# EasyEDA Pro project 3轴6.0__esp32.eprj, schematic 2轴6.0原理图-V1.0
Board Name: 2轴6.0原理图-V1.0; Create Date: 2025-02-12; Page Name: 2轴6.0原理图-V1.0; Project Name: 3轴6.0__esp32; Schematic Name: 2轴6.0原理图-V1.0; Update Date: 2025-02-19; Address1: *; Address2: *; Address3: *; Address4: *; Application_BuildNumber: *; ApprovedBy: *; Author: *; CheckedBy: *; CompanyName: *; CurrentDate: *; CurrentTime: *; Date: *; DocumentFullPathAndName: *; DocumentName: *; DocumentNumber: *; DrawnBy: *; Engineer: *; ImagePath: *; ModifiedDate: *; Organization: *; ProjectName: *; Revision: *; Rule: *; SheetNumber: *; SheetTotal: *; Time: *; Title: *
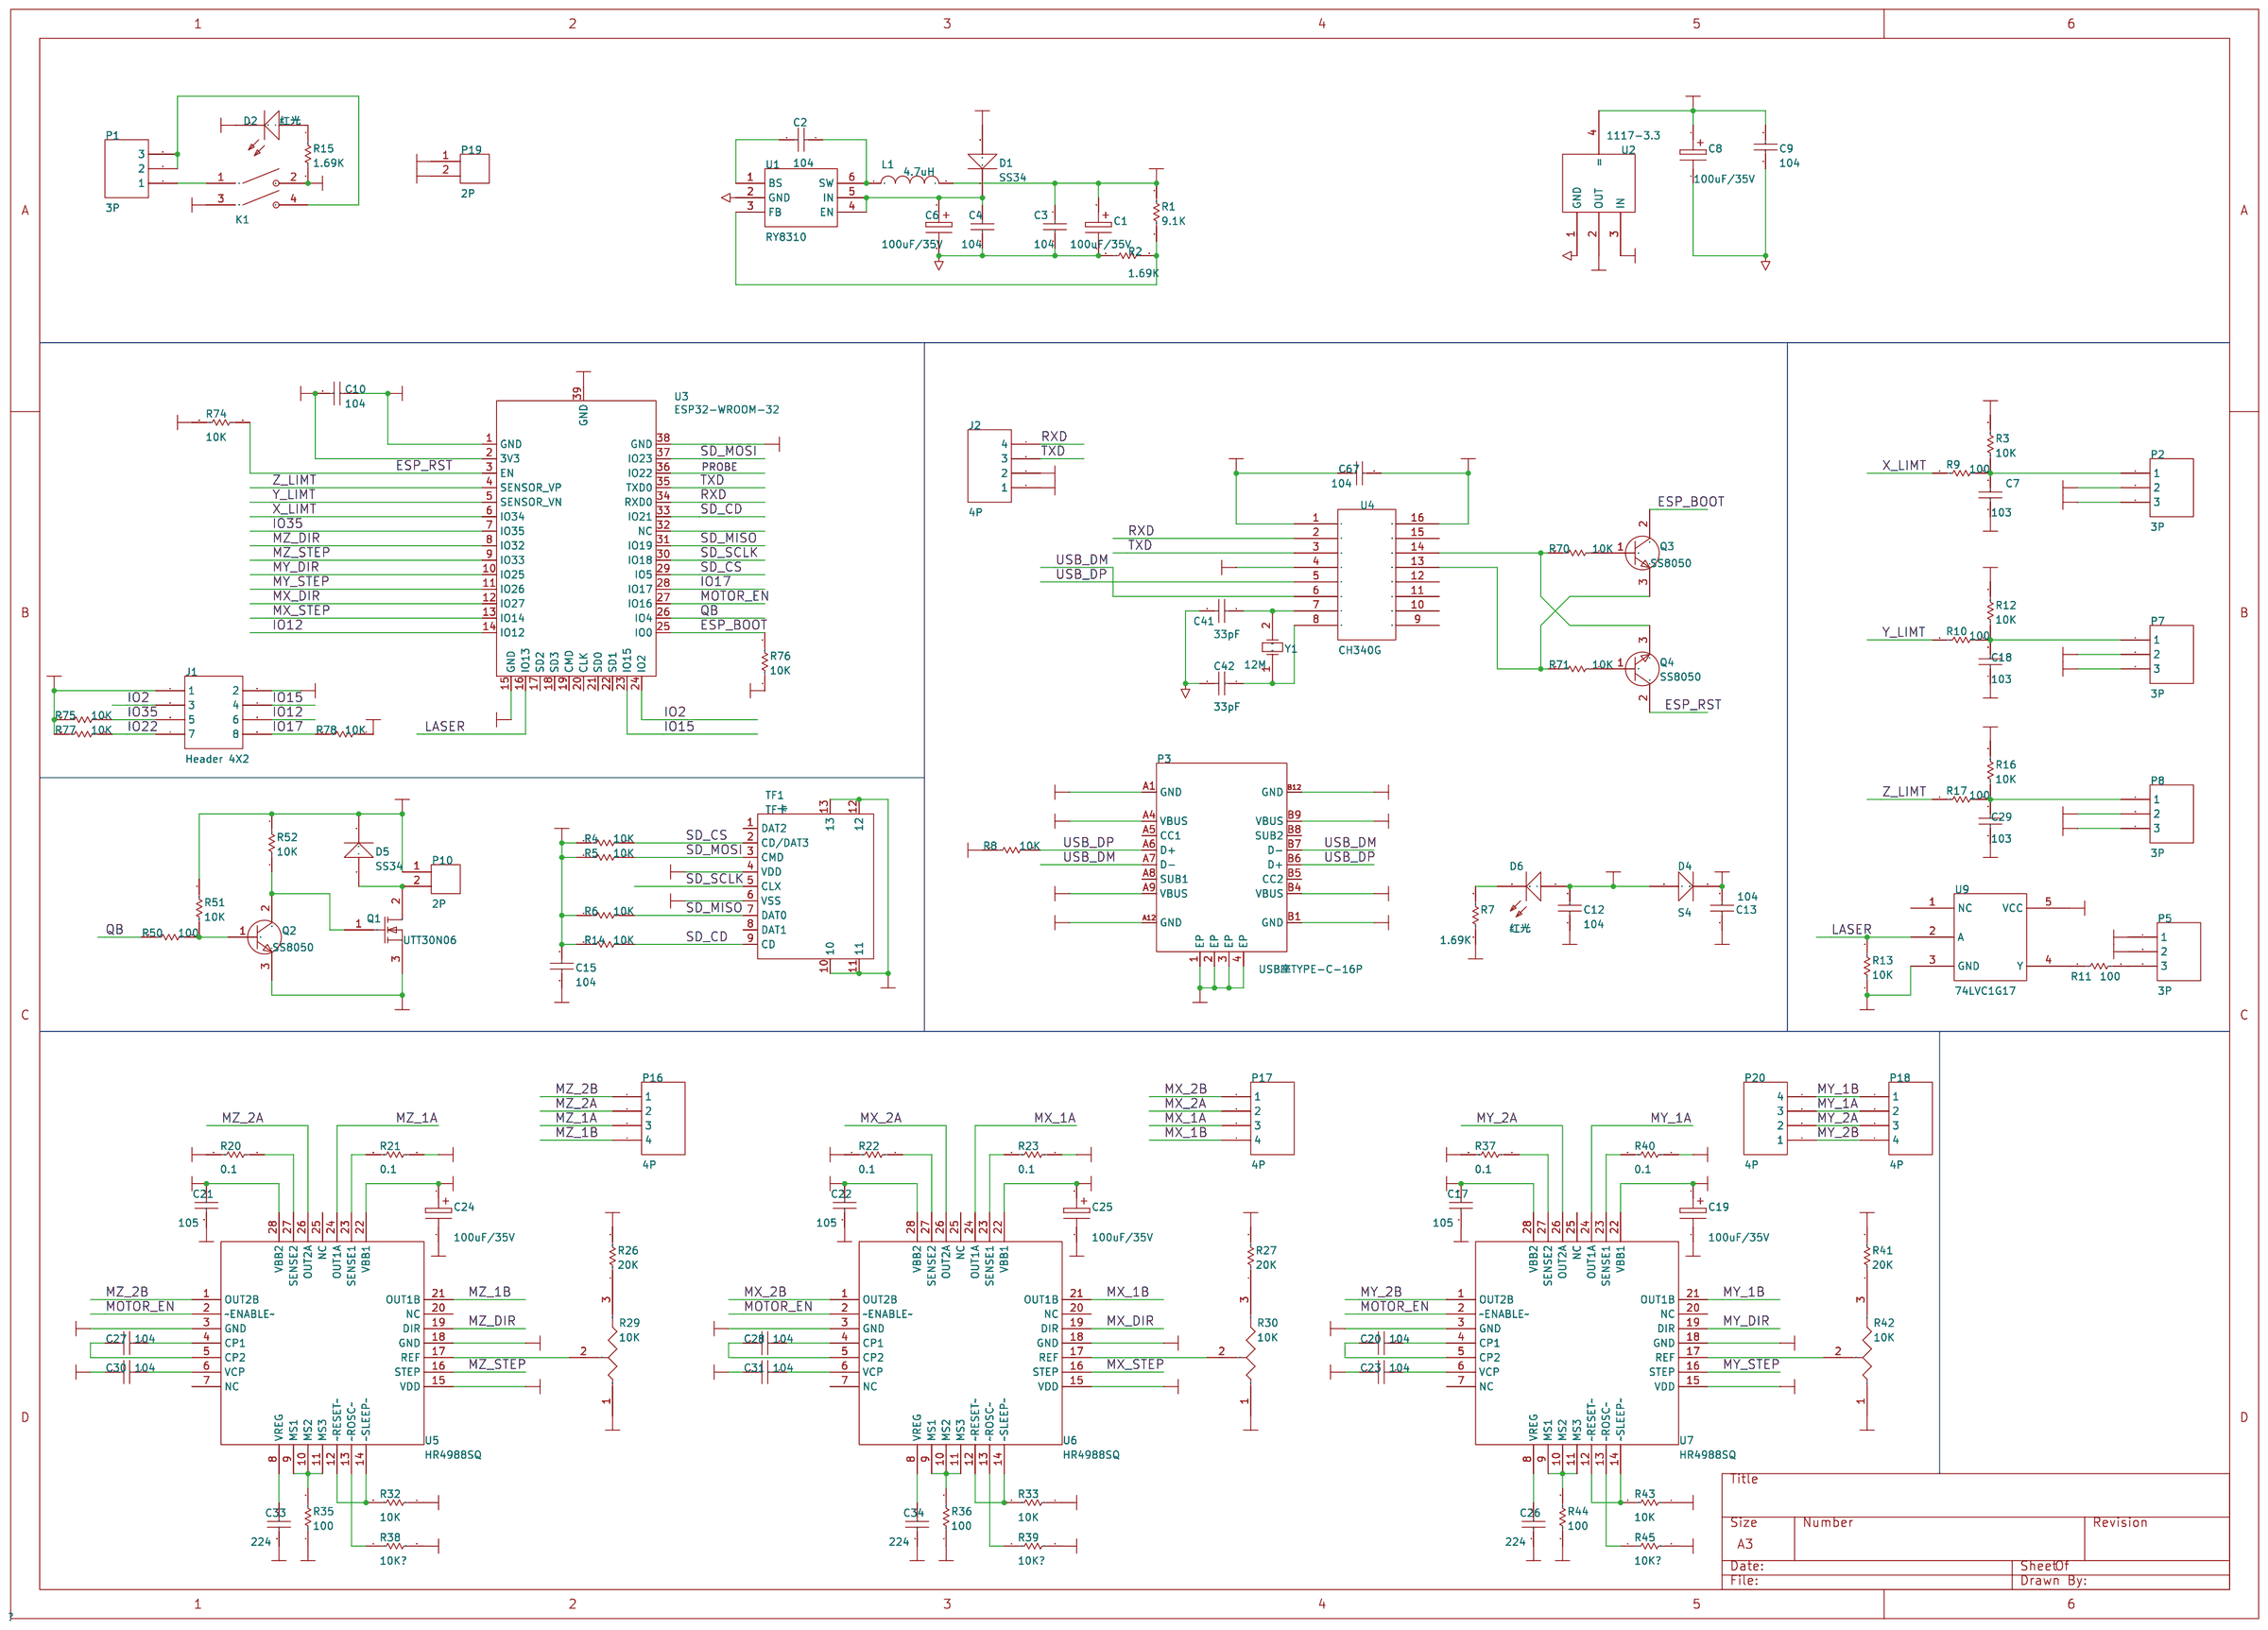
[diagram p0: schematic sheet]

## Parts
C1  100uF/35V  [9]
C2  104  [11]
C3  104  [11]
C4  104  [9]
C6  100uF/35V  [9]
C7  103  [11]
C8  100uF/35V  [9]
C9  104  [11]
C10  104  [9]
C12  104  [11]
C13  104  [9]
C15  104  [11]
C17  105  [11]
C18  103  [11]
C19  100uF/35V  [11]
C20  104  [11]
C21  105  [11]
C22  105  [11]
C23  104
C24  100uF/35V
C25  100uF/35V
C26  224
C27  104
C28  104
C29  103
C30  104
C31  104
C33  224
C34  224
C41  18pF
C42  18pF
C67  104
D1  SS34  [D]
D2  红光  [D]
D4  S4  [14]
D5  SS34  [14]
D6  红光  [D1]
J1  Header 4X2  [18]
J2  4P  [13]
K1  船形开关
L1  4.7uH  [20]
P1  3P
P2  3P
P3  USB座TYPE-C-16P
P5  3P
P7  3P
P8  3P
P10  2P
P16  4P
P17  4P
P18  4P
P19  2P
P20  4P
Q1  UTT30N06  [15]
Q2  SS8050  [15]
Q3  SS8050  [16]
Q4  SS8050  [16]
R1  9.1K  [10]
R2  1.69K  [10]
R3  10K  [10]
R4  10K  [10]
R5  10K  [10]
R6  10K  [10]
R7  1.69K  [10]
R8  10K  [10]
R9  100  [10]
R10  100  [10]
R11  100  [10]
R12  10K  [10]
R13  10K  [10]
R14  10K  [10]
R15  1.69K  [10]
R16  10K  [10]
R17  100  [10]
R20  0.1  [10]
R21  0.1  [10]
R22  0.1  [10]
R23  0.1  [10]
R26  20K  [10]
R27  20K  [10]
R29  10K  [10]
R30  10K  [10]
R32  10K  [10]
R33  10K  [10]
R35  100  [10]
R36  100  [10]
R37  0.1  [10]
R38  10K?  [10]
R39  10K?  [10]
R40  0.1  [10]
R41  20K  [10]
R42  10K  [10]
R43  10K  [10]
R44  100  [10]
R45  10K?  [10]
R50  100
R51  10K
R52  10K
R70  10K
R71  10K
R74  10K
R75  10K
R76  10K
R77  10K
R78  10K
TF1  TF卡
U1  RY8310  [U]
U2  1117-3.3  [17]
U3  ESP32-WROOM-32  [23]
U4  CH340G  [25]
U5  HR4988SQ  [U1]
U6  HR4988SQ  [4]
U7  HR4988SQ
U9  74LVC1G17
Y1  12M  [26]

## Library data of the parts
C1 C6 C8 C19 C24 C25 = 100uF/35V: Origin Footprint 2: X47U; Origin Footprint 1: 电解电容贴片6x6; Design Item ID: ELECTRO1; Library Name: *
C2 C4 C20 C23 C27 C28 C30 C31 = 104: Design Item ID: CAP; Library Name: SCH封装库
C3 C9 C12 C15 = 104: Capacitor (Semiconductor SIM Model); Published: 8-Jun-2000; LatestRevisionDate: 17-Jul-2002; LatestRevisionNote: Re-released for DXP Platform.; PackageReference: C1206; Publisher: Altium Limited; Origin Footprint 2: C1206; Origin Footprint 3: 0402; Origin Footprint 4: 1310[0504]; Origin Footprint 5: 1608[0603]; Origin Footprint 6: C1210; Origin Footprint 7: C0805; Origin Footprint 8: C1206; Origin Footprint 9: 0805; Origin Footprint 10: 0805L; Origin Footprint 11: 0805C; Origin Footprint 1: 0603C; Design Item ID: Cap Semi; Library Name: Miscellaneous Devices
C7 C18 C29 = 103: Design Item ID: CAP; Library Name: SCH封装库
C10 C13 C67 = 104: Capacitor (Semiconductor SIM Model); Published: 8-Jun-2000; LatestRevisionDate: 17-Jul-2002; LatestRevisionNote: Re-released for DXP Platform.; PackageReference: C1206; Publisher: Altium Limited; Origin Footprint 2: C1206; Origin Footprint 3: 0402; Origin Footprint 4: 1310[0504]; Origin Footprint 5: 1608[0603]; Origin Footprint 6: C1210; Origin Footprint 7: C0805; Origin Footprint 8: C1206; Origin Footprint 9: 0805; Origin Footprint 10: 0805L; Origin Footprint 1: 0603C; Design Item ID: Cap Semi; Library Name: Miscellaneous Devices
C17 C21 C22 = 105: Design Item ID: CAP; Library Name: SCH封装库
C26 C33 C34 = 224: Design Item ID: CAP; Library Name: SCH封装库
C41 C42 = 33pF: Capacitor (Semiconductor SIM Model); Published: 8-Jun-2000; LatestRevisionDate: 17-Jul-2002; LatestRevisionNote: Re-released for DXP Platform.; PackageReference: C1206; Publisher: Altium Limited; Origin Footprint 2: C1206; Origin Footprint 3: 0402; Origin Footprint 4: 1310[0504]; Origin Footprint 5: 1608[0603]; Origin Footprint 6: C1210; Origin Footprint 7: C0805; Origin Footprint 8: C1206; Origin Footprint 9: 0805; Origin Footprint 10: 0805L; Origin Footprint 1: 0603C; Design Item ID: Cap Semi; Library Name: Miscellaneous Devices
D1 D5 = SS34: Design Item ID: 1N4148; Library Name: SCH封装库
D2 D6 = 红光: Origin Footprint 2: LED(小); Origin Footprint 1: 0603LED; Design Item ID: LED; Library Name: SCH封装库
D4 = S4: Design Item ID: 1N4148; Library Name: SCH封装库
J1 = Header 4X2: Header, 4-Pin, Dual row; LatestRevisionDate: 17-Jul-2002; LatestRevisionNote: Re-released for DXP Platform.; Publisher: Altium Limited; Library Name: Miscellaneous Connectors
J2 P16-P18 P20 = 4P: Library Name: SCH封装库
K1 = 船形开关: Origin Footprint 2: 按键（小）; Origin Footprint 3: 侧立按键; Origin Footprint 1: 船形开关KCD1-104-4P; Design Item ID: 船形开关双刀; Library Name: SCH封装库
L1 = 4.7uH: Inductor; Published: 8-Jun-2000; LatestRevisionDate: 29-May-2009; LatestRevisionNote: IPC-7351 Footprint Added.; PackageReference: 0402-A; Publisher: Altium Limited; PackageDescription: Chip Inductor; Code_JEITA: 0402; Code_IEC: 1005; Origin Footprint 2: INDC1608L; Origin Footprint 3: INDC2012L; Origin Footprint 4: INDC0603L; Origin Footprint 5: INDC3216AL; Origin Footprint 6: INDC4532L; Origin Footprint 1: 电感贴片7x7; Design Item ID: Inductor; Library Name: SCH封装库
P1 P2 P5 P7 P8 = 3P: Library Name: SCH封装库
P3 = USB座TYPE-C-16P: Supplier: LCSC; Supplier Part: C709358; Manufacturer: Shenzhen Kinghelm Elec; Manufacturer Part: KH-TYPE-C-16P-T; Library Name: SCH封装库
P10 P19 = 2P: Library Name: SCH封装库
Q1 = UTT30N06: N-Channel MOSFET; Published: 8-Jun-2000; LatestRevisionDate: 17-Jul-2002; LatestRevisionNote: Re-released for DXP Platform.; PackageVersion: 1995/1996; PackageReference: E3; Publisher: Altium Limited; Design Item ID: MOSFET-N; Library Name: SCH封装库
Q2-Q4 = SS8050: Published: 8-Jun-2000; LatestRevisionDate: 17-Jul-2002; LatestRevisionNote: Re-released for DXP Platform.; PackageReference: TO-226; Publisher: Altium Limited; Code_JEDEC: TO-226-AA; Origin Footprint 2: TO-92; Origin Footprint 3: SOT-23; Origin Footprint 1: SOT-23; Design Item ID: NPN; Library Name: SCH封装库
R1 = 9.1K: Resistor; Published: 8-Jun-2000; LatestRevisionDate: 17-Jul-2002; LatestRevisionNote: Re-released for DXP Platform.; PackageReference: AXIAL-0.3; Publisher: Altium Limited; Origin Footprint 2: AXIAL-0.3; Origin Footprint 3: R0805; Origin Footprint 4: 0805R; Origin Footprint 1: 0603R; Design Item ID: RES; Library Name: SCH封装库
R2 R7 R15 = 1.69K: Resistor; Published: 8-Jun-2000; LatestRevisionDate: 17-Jul-2002; LatestRevisionNote: Re-released for DXP Platform.; PackageReference: AXIAL-0.3; Publisher: Altium Limited; Origin Footprint 2: AXIAL-0.3; Origin Footprint 3: R0805; Origin Footprint 4: 0805R; Origin Footprint 1: 0603R; Design Item ID: RES; Library Name: SCH封装库
R3-R6 R12-R14 R16 R32 R33 R43 R51 R52 R70 R71 R74-R78 = 10K: Resistor; Published: 8-Jun-2000; LatestRevisionDate: 17-Jul-2002; LatestRevisionNote: Re-released for DXP Platform.; PackageReference: AXIAL-0.3; Publisher: Altium Limited; Origin Footprint 2: AXIAL-0.3; Origin Footprint 3: R0805; Origin Footprint 4: 0805R; Origin Footprint 1: 0603R; Design Item ID: RES; Library Name: SCH封装库
R8 = 10K: Resistor; Published: 8-Jun-2000; LatestRevisionDate: 17-Jul-2002; LatestRevisionNote: Re-released for DXP Platform.; PackageReference: AXIAL-0.3; Publisher: Altium Limited; Origin Footprint 2: AXIAL-0.3; Origin Footprint 3: R0805; Origin Footprint 4: 0603R; Origin Footprint 1: 0603R; Design Item ID: RES; Library Name: SCH封装库
R9-R11 R17 R35 R36 R44 R50 = 100: Resistor; Published: 8-Jun-2000; LatestRevisionDate: 17-Jul-2002; LatestRevisionNote: Re-released for DXP Platform.; PackageReference: AXIAL-0.3; Publisher: Altium Limited; Origin Footprint 2: AXIAL-0.3; Origin Footprint 3: R0805; Origin Footprint 4: 0805R; Origin Footprint 1: 0603R; Design Item ID: RES; Library Name: SCH封装库
R20-R23 R37 R40 = 0.1: Resistor; Published: 8-Jun-2000; LatestRevisionDate: 17-Jul-2002; LatestRevisionNote: Re-released for DXP Platform.; PackageReference: AXIAL-0.3; Publisher: Altium Limited; Origin Footprint 2: AXIAL-0.3; Origin Footprint 3: R0805; Origin Footprint 4: 0603R; Origin Footprint 1: 0805R; Design Item ID: RES; Library Name: SCH封装库
R26 R27 R41 = 20K: Resistor; Published: 8-Jun-2000; LatestRevisionDate: 17-Jul-2002; LatestRevisionNote: Re-released for DXP Platform.; PackageReference: AXIAL-0.3; Publisher: Altium Limited; Origin Footprint 2: AXIAL-0.3; Origin Footprint 3: R0805; Origin Footprint 4: 0805R; Origin Footprint 1: 0603R; Design Item ID: RES; Library Name: SCH封装库
R29 R30 R42 = 10K: Design Item ID: 电位器; Library Name: SCH封装库
R38 R39 R45 = 10K?: Resistor; Published: 8-Jun-2000; LatestRevisionDate: 17-Jul-2002; LatestRevisionNote: Re-released for DXP Platform.; PackageReference: AXIAL-0.3; Publisher: Altium Limited; Origin Footprint 2: AXIAL-0.3; Origin Footprint 3: R0805; Origin Footprint 4: 0603R; Origin Footprint 1: 0603R; Design Item ID: RES; Library Name: SCH封装库
TF1 = TF卡: Supplier: LCSC; Supplier Part: C410350; Manufacturer: Hanbo Electronic; Manufacturer Part: TF-012; Design Item ID: TF-012; Library Name: SCH封装库
U1 = RY8310: Library Name: SCH封装库
U2 = 1117-3.3: Design Item ID: LM1117; Library Name: Party600
U3 = ESP32-WROOM-32: Supplier: LCSC; Supplier Part: C473013; Manufacturer: Espressif Systems; Manufacturer Part: ESP32-WROOM-32DC; Design Item ID: ESP32-WROOM-32DC; Library Name: SCH封装库
U4 = CH340G: Design Item ID: DIP16; Library Name: SCH封装库
U5-U7 = HR4988SQ: Design Item ID: HR4988; Library Name: SCH封装库
U9 = 74LVC1G17: Library Name: SCH封装库
Y1 = 12M: Crystal Oscillator; Published: 8-Jun-2000; LatestRevisionDate: 17-Jul-2002; LatestRevisionNote: Re-released for DXP Platform.; PackageReference: R38; Publisher: Altium Limited; Origin Footprint 2: R38; Origin Footprint 3: XTAL-49S; Origin Footprint 1: 晶振贴片49SSMD; Design Item ID: XTAL; Library Name: Miscellaneous Devices

## Nets
3V3: C8.1 C9.2 C10.2 C15.2 C67.2 R4.2 R5.2 R6.2 R8.1 R14.2 R74.2 R76.1 TF1.4(VDD) U2.2(OUT) U2.4(=) U3.2(3V3) U4.4 U4.16
12V: C17.1 C19.1 C21.1 C22.1 C23.2 C24.1 C25.1 C30.2 C31.2 D1.1 D5.2 K1.2 P5.1 P10.1 P19.2 R15.2 R51.1 R52.1 U5.22(VBB1) U5.28(VBB2) U6.22(VBB1) U6.28(VBB2) U7.22(VBB1) U7.28(VBB2)
GND: C1.2 C3.1 C4.2 C6.2 C7.1 C8.2 C9.1 C10.1 C12.1 C13.1 C15.1 C17.2 C18.1 C19.2 C21.2 C22.2 C24.2 C25.2 C26.2 C29.1 C33.2 C34.2 C41.2 C42.2 C67.1 D2.2 J1.2 J2.1 K1.3 P2.2 P3.1(EP) P3.2(EP) P3.3(EP) P3.4(EP) P3.A1(GND) P3.A12(GND) P3.B1(GND) P3.B12(GND) P5.2 P7.2 P8.2 P19.1 Q1.3(S) Q2.3(E) R2.1 R7.1 R13.1 R20.2 R21.1 R22.2 R23.1 R29.1(A) R30.1(A) R37.2 R38.2 R39.2 R40.1 R42.1(A) R45.2 TF1.6(VSS) TF1.10 TF1.11 TF1.12 TF1.13 U1.2(GND) U2.1(GND) U3.1(GND) U3.15(GND) U3.38(GND) U3.39(GND) U4.1 U5.3(GND) U5.18(GND) U6.3(GND) U6.18(GND) U7.3(GND) U7.18(GND) U9.3(GND)
VCC: C1.1 C3.2 C13.2 D4.2 J1.1 J2.2 L1.2 P2.3 P7.3 P8.3 R1.2 R3.2 R12.2 R16.2 R26.2 R27.2 R32.1 R33.1 R35.1 R36.1 R41.2 R43.1 R44.1 R75.2 R77.2 R78.1 U2.3(IN) U5.15(VDD) U6.15(VDD) U7.15(VDD) U9.5(VCC)
ESP_BOOT: Q3.2(C) R76.2 U3.25(IO0)
ESP_RST: Q4.2(C) R74.1 U3.3(EN)
IO2: J1.3 U3.24(IO2)
IO12: J1.6 U3.14(IO12)
IO15: J1.4 U3.23(IO15)
IO17: J1.8 R78.2 U3.28(IO17)
IO22: J1.7 R77.1
IO35: J1.5 R75.1 U3.7(IO35)
LASER: R13.2 U3.16(IO13) U9.2(A)
MOTOR_EN: U3.27(IO16) U5.2(~ENABLE~) U6.2(~ENABLE~) U7.2(~ENABLE~)
MX_1A: P17.3 U6.24(OUT1A)
MX_1B: P17.4 U6.21(OUT1B)
MX_2A: P17.2 U6.26(OUT2A)
MX_2B: P17.1 U6.1(OUT2B)
MX_DIR: U3.12(IO27) U6.19(DIR)
MX_STEP: U3.13(IO14) U6.16(STEP)
MY_1A: P18.2 P20.3 U7.24(OUT1A)
MY_1B: P18.1 P20.4 U7.21(OUT1B)
MY_2A: P18.3 P20.2 U7.26(OUT2A)
MY_2B: P18.4 P20.1 U7.1(OUT2B)
MY_DIR: U3.10(IO25) U7.19(DIR)
MY_STEP: U3.11(IO26) U7.16(STEP)
MZ_1A: P16.3 U5.24(OUT1A)
MZ_1B: P16.4 U5.21(OUT1B)
MZ_2A: P16.2 U5.26(OUT2A)
MZ_2B: P16.1 U5.1(OUT2B)
MZ_DIR: U3.8(IO32) U5.19(DIR)
MZ_STEP: U3.9(IO33) U5.16(STEP)
PROBE: U3.36(IO22)
QB: R50.2 U3.26(IO4)
RXD: J2.4 U3.34(RXD0) U4.2
SD_CD: R14.1 TF1.9(CD) U3.33(IO21)
SD_CS: R4.1 TF1.2(CD/DAT3) U3.29(IO5)
SD_MISO: R6.1 TF1.7(DAT0) U3.31(IO19)
SD_MOSI: R5.1 TF1.3(CMD) U3.37(IO23)
SD_SCLK: TF1.5(CLX) U3.30(IO18)
TXD: J2.3 U3.35(TXD0) U4.3
USB_DM: P3.A7(D-) P3.B7(D-) U4.6
USB_DP: P3.A6(D+) P3.B6(D+) R8.2 U4.5
VUSB: C12.2 D4.1 D6.1 P3.A4(VBUS) P3.A9(VBUS) P3.B4(VBUS) P3.B9(VBUS)
X_LIMT: R9.2 U3.6(IO34)
Y_LIMT: R10.2 U3.5(SENSOR_VN)
Z_LIMT: R17.2 U3.4(SENSOR_VP)
Net-(C2-1): C2.1 L1.1 U1.6(SW)
Net-(C2-2): C2.2 U1.1(BS)
Net-(C4-1): C4.1 C6.1 D1.2 U1.4(EN) U1.5(IN)
Net-(C7-2): C7.2 P2.1 R3.1 R9.1
Net-(C18-2): C18.2 P7.1 R10.1 R12.1
Net-(C20-1): C20.1 U7.4(CP1)
Net-(C20-2): C20.2 U7.5(CP2)
Net-(C23-1): C23.1 U7.6(VCP)
Net-(C26-1): C26.1 U7.8(VREG)
Net-(C27-1): C27.1 U5.4(CP1)
Net-(C27-2): C27.2 U5.5(CP2)
Net-(C28-1): C28.1 U6.4(CP1)
Net-(C28-2): C28.2 U6.5(CP2)
Net-(C29-2): C29.2 P8.1 R16.1 R17.1
Net-(C30-1): C30.1 U5.6(VCP)
Net-(C31-1): C31.1 U6.6(VCP)
Net-(C33-1): C33.1 U5.8(VREG)
Net-(C34-1): C34.1 U6.8(VREG)
Net-(C41-1): C41.1 U4.7 Y1.2(OSC2)
Net-(C42-1): C42.1 U4.8 Y1.1(OSC1)
Net-(D2-1): D2.1 R15.1
Net-(D5-1): D5.1 P10.2 Q1.2(D)
Net-(D6-2): D6.2 R7.2
Net-(K1-1): K1.1 P1.1
Net-(K1-4): K1.4 P1.2 P1.3
Net-(P5-3): P5.3 R11.2
Net-(Q1-1): Q1.1(G) Q2.2(C) R52.2
Net-(Q2-1): Q2.1(B) R50.1 R51.2
Net-(Q3-1): Q3.1(B) R70.1
Net-(Q3-3): Q3.3(E) R71.2 U4.13
Net-(Q4-1): Q4.1(B) R71.1
Net-(Q4-3): Q4.3(E) R70.2 U4.14
Net-(R1-1): R1.1 R2.2 U1.3(FB)
Net-(R11-1): R11.1 U9.4(Y)
Net-(R20-1): R20.1 U5.27(SENSE2)
Net-(R21-2): R21.2 U5.23(SENSE1)
Net-(R22-1): R22.1 U6.27(SENSE2)
Net-(R23-2): R23.2 U6.23(SENSE1)
Net-(R26-1): R26.1 R29.3(B)
Net-(R27-1): R27.1 R30.3(B)
Net-(R29-2): R29.2(TAP) U5.17(REF)
Net-(R30-2): R30.2(TAP) U6.17(REF)
Net-(R32-2): R32.2 U5.12(~RESET~) U5.14(~SLEEP~)
Net-(R33-2): R33.2 U6.12(~RESET~) U6.14(~SLEEP~)
Net-(R35-2): R35.2 U5.9(MS1) U5.10(MS2) U5.11(MS3)
Net-(R36-2): R36.2 U6.9(MS1) U6.10(MS2) U6.11(MS3)
Net-(R37-1): R37.1 U7.27(SENSE2)
Net-(R38-1): R38.1 U5.13(~ROSC~)
Net-(R39-1): R39.1 U6.13(~ROSC~)
Net-(R40-2): R40.2 U7.23(SENSE1)
Net-(R41-1): R41.1 R42.3(B)
Net-(R42-2): R42.2(TAP) U7.17(REF)
Net-(R43-2): R43.2 U7.12(~RESET~) U7.14(~SLEEP~)
Net-(R44-2): R44.2 U7.9(MS1) U7.10(MS2) U7.11(MS3)
Net-(R45-1): R45.1 U7.13(~ROSC~)

Not connected (* = marked no-connect by the designer): P3 A5(CC1) A8(SUB1) B5(CC2) B8(SUB2); TF1 1(DAT2) 8(DAT1); U3 17(SD2) 18(SD3) 19(CMD) 20(CLK) 21(SD0) 22(SD1) 32(NC); U4 9 10 11 12 15; U5 7(NC) 20(NC) 25(NC); U6 7(NC) 20(NC) 25(NC); U7 7(NC) 20(NC) 25(NC); U9 1(NC)
